# Altium schematic sheet DustCollectorSwitch.SchDoc
size A4
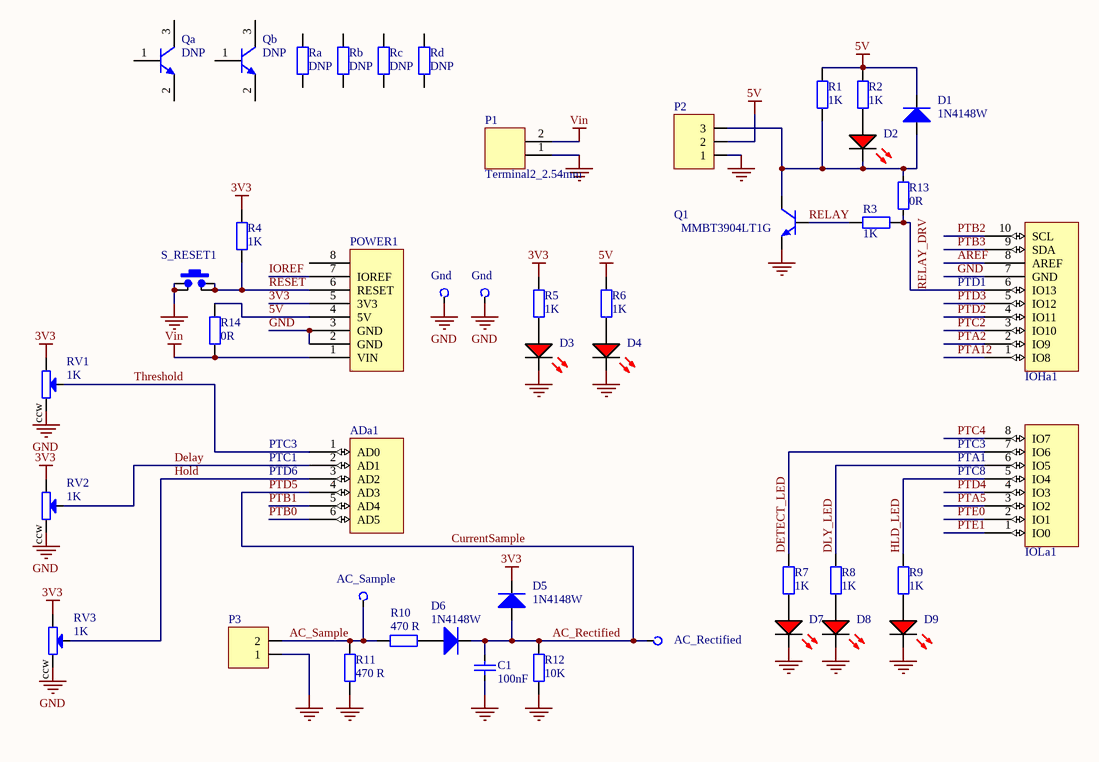
[diagram p0: DustCollectorSwitch.SchDoc]

## Parts
AC_Rectified  Vdd  [PCBPIN - 0.9mm]  (value not drawn)  (no BOM)
AC_Sample  Vdd  [PCBPIN - 0.9mm]  (value not drawn)  (no BOM)
ADa1  AD  [Header 6x1 8.5mm]  (value not drawn)
C1  100nF  [CCNP1608-0603_N]
D1  1N4148W  [SOD-123]
D2  LED Red  [LED1608-0603-RED]  (value not drawn)
D3  LED Red  [LED1608-0603-RED]  (value not drawn)
D4  LED Red  [LED1608-0603-RED]  (value not drawn)
D5  1N4148W  [SOD-123]
D6  1N4148W  [SOD-123]
D7  LED Red  [LED1608-0603-RED]  (value not drawn)
D8  LED Red  [LED1608-0603-RED]  (value not drawn)
D9  LED Red  [LED1608-0603-RED]  (value not drawn)
Gnd1  Gnd  [PCBPIN - 0.9mm]  (no BOM)
Gnd?  Gnd  [PCBPIN - 0.9mm]  (no BOM)
IOHa1  IOH  [Header 10x1 8.5mm]  (value not drawn)
IOLa1  IOL  [Header 8x1 8.5mm]  (value not drawn)
P1  Terminal2_2.54mm  [TYCO-282834-2]
P2  Header, 3-Pin, Right Angle  [HDR1X3H]  (value not drawn)
P3  Header, 2-Pin, Right Angle  [HDR1X2H]  (value not drawn)
POWER1  POWER_UNO  [Header 8x1 8.5mm]  (value not drawn)
Q1  MMBT3904LT1G  [SOT23_N]
Qa  DNP  [SOT23_M]  (no BOM)
Qb  DNP  [SOT23_M]  (no BOM)
R1  1K  [CR1608-0603_N]
R2  1K  [CR1608-0603_N]
R3  1K  [CR1608-0603_N]
R4  1K  [CR1608-0603_N]
R5  1K  [CR1608-0603_N]
R6  1K  [CR1608-0603_N]
R7  1K  [CR1608-0603_N]
R8  1K  [CR1608-0603_N]
R9  1K  [CR1608-0603_N]
R10  470 R  [CR1608-0603_N]
R11  470 R  [CR1608-0603_N]
R12  10K  [CR1608-0603_N]
R13  0R  [CR1608-0603_N]
R14  0R  [CR1608-0603_N]
Ra  DNP  [CR1608-0603_N]  (no BOM)
Rb  DNP  [CR1608-0603_N]  (no BOM)
Rc  DNP  [CR1608-0603_N]  (no BOM)
Rd  DNP  [CR1608-0603_N]  (no BOM)
RV1  1K  [BOURNS 3362P]
RV2  1K  [BOURNS 3362P]
RV3  1K  [BOURNS 3362P]
S_RESET1  SMD-SW-4_5.1x5.1x3.5_M  [SMD-SW-4_5.1x5.1x3.5_M]  (value not drawn)

## Nets
3V3: D5.K POWER1.5(3V3) R4.2 R5.2 RV1.cw RV2.cw RV3.cw
5V: D1.K P2.2 POWER1.4(5V) R1.2 R2.2 R6.2 R14.1
GND: C1.2 D3.K D4.K D7.K D8.K D9.K Gnd1.1(TP) Gnd?.1(TP) IOHa1.7(GND) P1.1 P2.1 P3.1 POWER1.2(GND) POWER1.3(GND) Q1.2(E) R11.2 R12.2 RV1.ccw RV2.ccw RV3.ccw S_RESET1.1 S_RESET1.1b
Vin: P1.2 POWER1.1(VIN) R14.2
AC_Rectified: AC_Rectified.1(TP) ADa1.4(AD3) C1.1 D5.A D6.K R12.1  [also labelled CurrentSample, PTD5]
AC_Sample: AC_Sample.1(TP) P3.2 R10.2 R11.1
AREF: IOHa1.8(AREF)
Delay: ADa1.2(AD1) RV2.w
DETECT_LED: IOLa1.7(IO6) R7.2
DLY_LED: IOLa1.6(IO5) R8.2
HLD_LED: IOLa1.5(IO4) R9.2
Hold: ADa1.3(AD2) RV3.w
IOREF: POWER1.7(IOREF)
PTA2: IOHa1.2(IO9)
PTA5: IOLa1.3(IO2)
PTA12: IOHa1.1(IO8)
PTB0: ADa1.6(AD5)
PTB1: ADa1.5(AD4)
PTB2: IOHa1.10(SCL)
PTB3: IOHa1.9(SDA)
PTC2: IOHa1.3(IO10)
PTC4: IOLa1.8(IO7)
PTD2: IOHa1.4(IO11)
PTD3: IOHa1.5(IO12)
PTD4: IOLa1.4(IO3)
PTE0: IOLa1.2(IO1)
PTE1: IOLa1.1(IO0)
RELAY: Q1.1(B) R3.2
RELAY_DRV: IOHa1.6(IO13) R3.1 R13.2
RESET: POWER1.6(RESET) R4.1 S_RESET1.2 S_RESET1.2b
Threshold: ADa1.1(AD0) RV1.w
NetD1_A: D1.A D2.K P2.3 Q1.3(C) R1.1 R13.1
NetD2_A: D2.A R2.1
NetD3_A: D3.A R5.1
NetD4_A: D4.A R6.1
NetD6_A: D6.A R10.1
NetD7_A: D7.A R7.1
NetD8_A: D8.A R8.1
NetD9_A: D9.A R9.1

Not connected (* = marked no-connect by the designer): POWER1 8; Qa 1(B) 2(E) 3(C); Qb 1(B) 2(E) 3(C); Ra 1 2; Rb 1 2; Rc 1 2; Rd 1 2

## Notes on the sheet
- (near IOHa1) PTD1
- PTC3
- PTC1
- PTD6
- (near IOLa1) PTC3
- (near IOLa1) PTA1
- (near IOLa1) PTC8

## Library data of the parts
AC_Rectified AC_Sample Gnd1 Gnd? = TP: Test Point; Digikey: *; Farnell PN: *; LCSC: *
C1 = Cap_CCNP_0603_100nF: Capacitor non-polar SMT 0603; Manufacturer: Generic Components; Class: Passive; Published: 08/06/2000; Publisher: Altium Hobart Technology Centre; SubClass: Capacitor; Farnell PN: *; Digikey: *; Value: 100nF; LCSC: C14663
D1 D5 D6 = 1N4148W: Diode - Switching 75V 150mA 1.25V @ 150mA 4ns, SOD-123; Class: Discrete; SubClass: Diode - Switching; Digikey: *; Farnell PN: *; LCSC: C81598
D2-D4 D7-D9 = LED-0603-Red: LED 0603 Red; Manufacturer: Generic Components; Class I: Optoelectronic; Published: 8-Jun-2000; Revision: July-2002: Re-released for DXP Platform.; Publisher: Altium Limited; Class II: LED; Farnell PN: 1581239; Digikey: *; LCSC: C2286
P1 = Terminal2_2.54mm: TE 282834-2 Terminal Block, 2.54 mm, 2 Ways, 30 AWG, 16 AWG, Screw; Farnell PN: 2112482; LCSC: *
P2 = Header 1x3H: LatestRevisionDate: 17-Jul-2002; LatestRevisionNote: Re-released for DXP Platform.; Publisher: Altium Limited; LCSC: *
P3 = Header 1x2H: LatestRevisionDate: 17-Jul-2002; LatestRevisionNote: Re-released for DXP Platform.; Publisher: Altium Limited; LCSC: *
Q1 = MMBT3904LT1G: General Purpose Transistor, NPN Silicon, 3-Pin SOT-23, Pb-Free, Tape and Reel; Manufacturer: On Semiconductor; IC Continuous (A): 0.2; fT Min (MHz): 300; ComponentLink2Description: Datasheet; Polarity: NPN; PackageDescription: 3-Pin Small Outline Transistor, Body 2.92 x 1.3 mm, Pitch 0.95 mm; ComponentLink2URL: http://www.onsemi.cn/pub_link/Collateral/MMBT3904LT1-D.PDF; DatasheetVersion: Rev. 12; Mounting Technology: Surface Mount; PartNumber: MMBT3904LT1G; ComponentLink1URL: http://www.onsemi.com/; ComponentLink3Description: Package Specification; ComponentLink1Description: Manufacturer URL; PackageVersion: Rev. AP, 11/2009; PackageReference: SOT-23-3-318-08; Packing: Tape and Reel; ComponentLink3URL: http://www.onsemi.cn/pub_link/Collateral/318-08.PDF; RoHS: TRUE; LCSC: C20526
Qa Qb = MMBT3904LT1G: SOT23; ComponentLink2Description: Datasheet; ComponentLink2URL: http://www.onsemi.cn/pub_link/Collateral/MMBT3904LT1-D.PDF; ComponentLink1URL: http://www.onsemi.com/; ComponentLink3Description: Package Specification; ComponentLink1Description: Manufacturer URL; ComponentLink3URL: http://www.onsemi.cn/pub_link/Collateral/318-08.PDF
R1-R14 Ra Rb Rc Rd = Res_CR0603: Resistor SMT 0603; Manufacturer: Generic Components; Class: Passive; Published: 08/06/2000; Publisher: Altium Hobart Technology Centre; SubClass: Resistor; Farnell PN: *; Digikey: *
  R1-R9: Value: 1K; LCSC: C21190
  R10 R11: Value: 470 R; LCSC: C23179
  R12: Value: 10K; LCSC: C23179
  R13 R14: Value: 0R; LCSC: C21190
  Ra Rb Rc Rd: Value: DNP
RV1-RV3 = POT_BOURNS_3362P: Trim Pot - single turn horizontal; Value: 1K; Digikey: *; Farnell PN: 9354298 or similar; LCSC: *
S_RESET1 = SW_PB-TS: Tactile Switch SPST 5.10mm X 5.10mm / (1.5mm=C318884) / (2.0mm=C318888) / (3.5mm=C318886); Revision: 1.0; LCSC: C318886
ADa1 = AD: Supplier 1: Arrow; Supplier Part Number 1: 2699089; Supplier 2: Digi-Key; Supplier Part Number 2: SAM1198-06-ND; Supplier 3: Arrow; Supplier Part Number 3: 2699088; Supplier 4: Arrow; Supplier Part Number 4: 2699075
IOHa1 = IOH: Supplier 1: Arrow; Supplier Part Number 1: 2698803S4475693N1004; Supplier 2: Digi-Key; Supplier Part Number 2: SAM1198-10-ND; Supplier 3: Arrow; Supplier Part Number 3: 2698789
IOLa1 = IOL: Supplier 1: Digi-Key; Supplier Part Number 1: SAM1198-08-ND; Supplier 2: Arrow; Supplier Part Number 2: 2698939; Supplier 3: Arrow; Supplier Part Number 3: 2698940; Supplier 4: Arrow; Supplier Part Number 4: 2698925
POWER1 = POWER_UNO: Supplier 1: Digi-Key; Supplier Part Number 1: SAM1198-08-ND; Supplier 2: Arrow; Supplier Part Number 2: 2698939; Supplier 3: Arrow; Supplier Part Number 3: 2698940; Supplier 4: Arrow; Supplier Part Number 4: 2698925